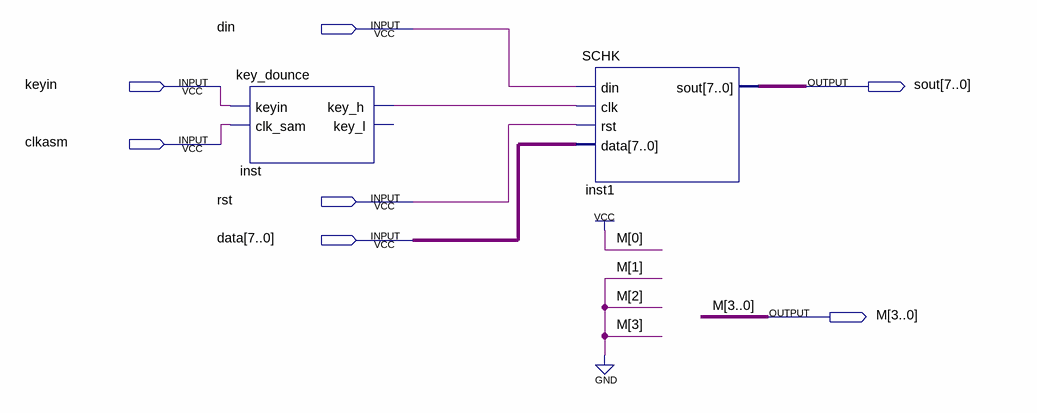
[diagram p0: schematic sheet]
// Quartus schematic detection.bdf as structural Verilog: 2 symbols, 7 pins
module detection (
  input  din,
  input  keyin,
  input  clkasm,
  input  rst,
  input  [7:0] data,
  output [7:0] sout,
  output [3:0] M
);

  wire inst_key_h;

  key_dounce inst (.keyin(keyin), .clk_sam(clkasm), .key_h(inst_key_h));  // open: key_l
  SCHK inst1 (.din(din), .clk(inst_key_h), .rst(rst), .data(data), .sout(sout));

  assign M = 4'b0001;
endmodule
